# EAGLE design SSB Transceiver_Digital (EAGLE 9.4.2)
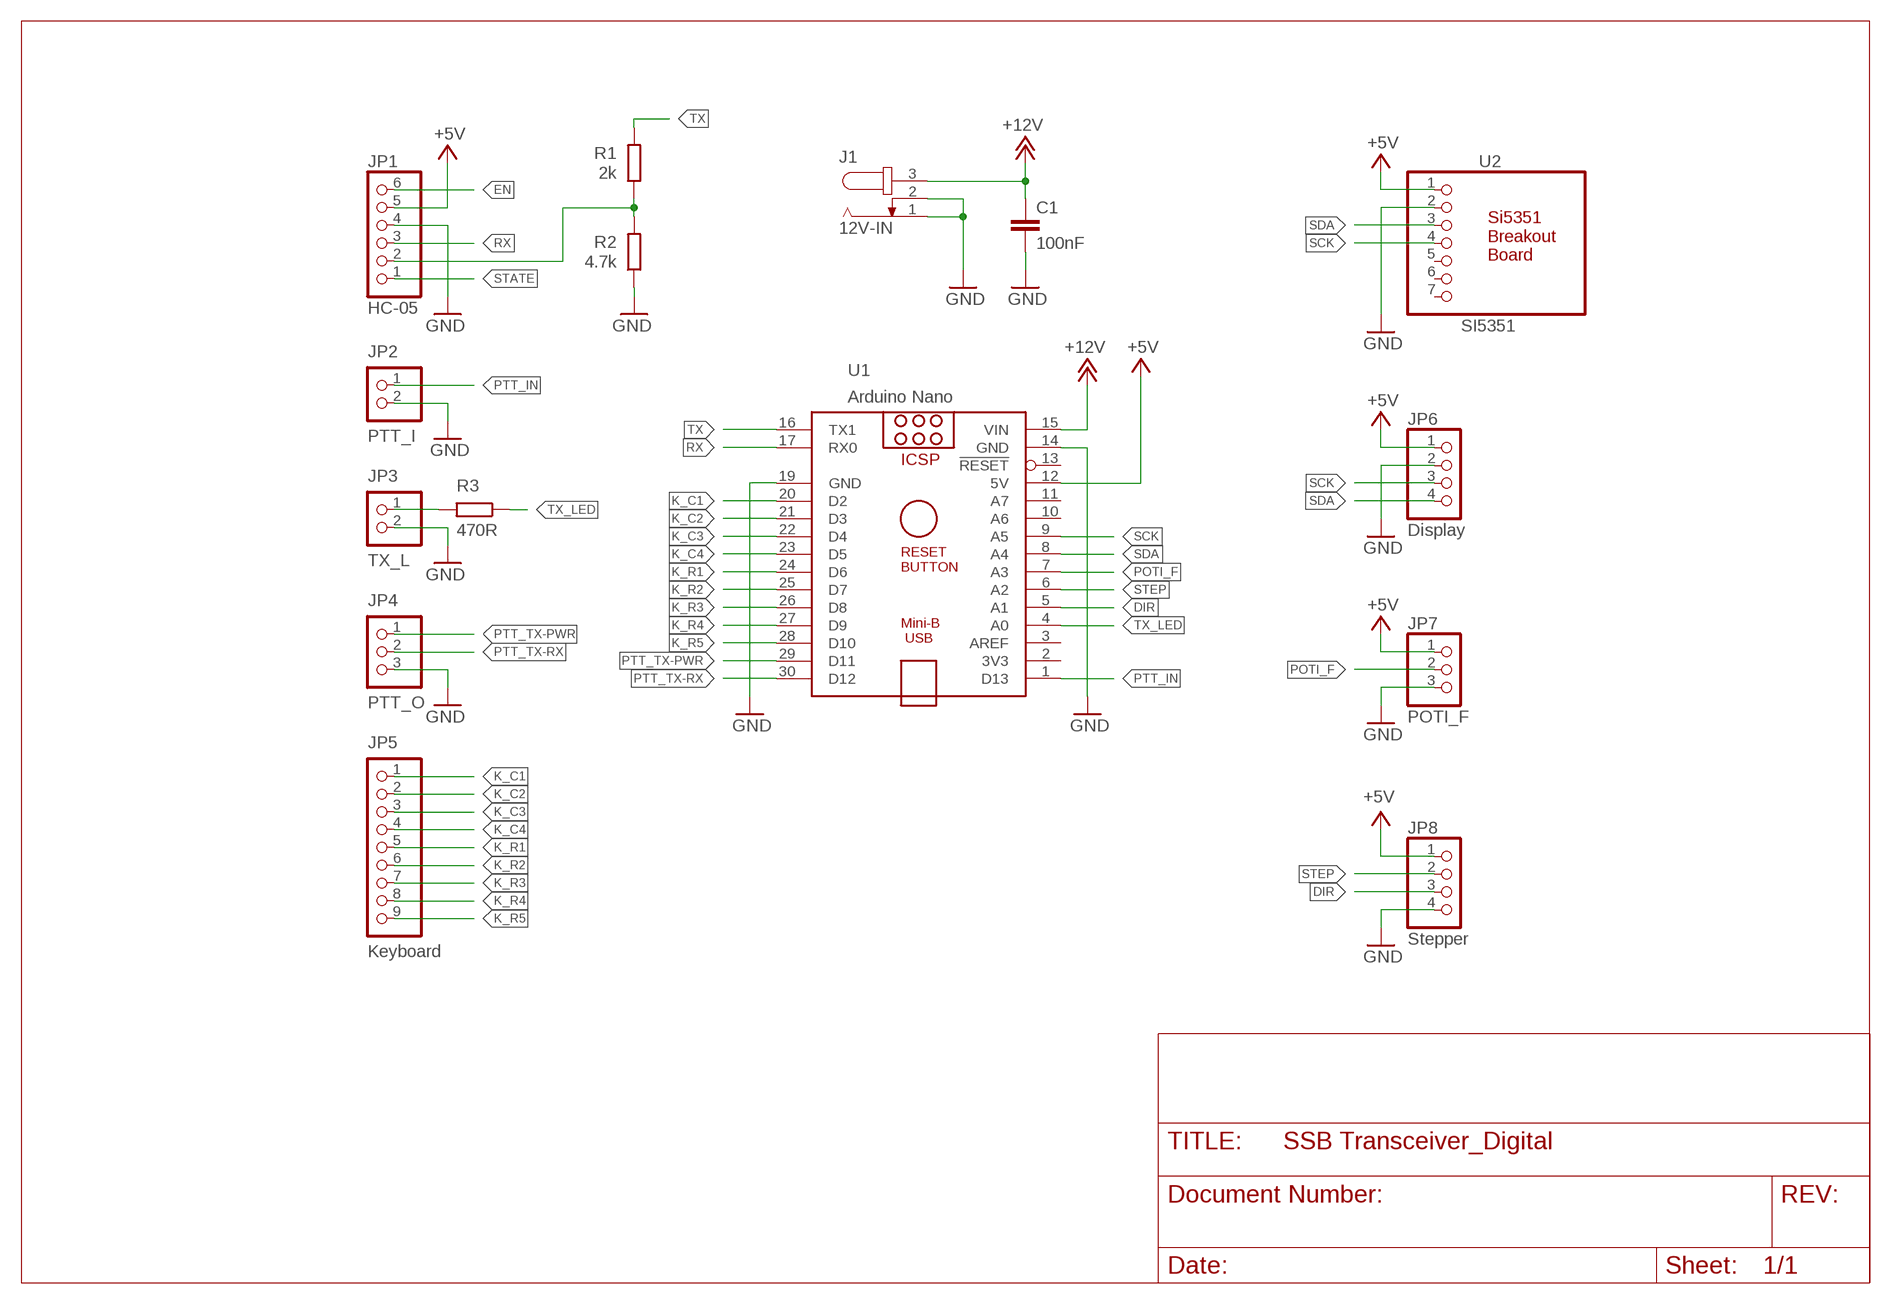
[diagram p0: schematic, sheet 1]

## Parts
C1  100nF  C-EUC0805K  [C0805K]
J1  12V-IN  JACK-PLUG1  [SPC4078]
JP1  HC-05  PINHD-1X6  [1X06]
JP2  PTT_I  PINHD-1X2  [1X02]
JP3  TX_L  PINHD-1X2  [1X02]
JP4  PTT_O  PINHD-1X3  [1X03]
JP5  Keyboard  PINHD-1X9  [1X09]
JP6  Display  PINHD-1X4  [1X04]
JP7  POTI_F  PINHD-1X3  [1X03]
JP8  Stepper  PINHD-1X4  [1X04]
R1  2k  R-EU_R0805  [R0805]
R2  4.7k  R-EU_R0805  [R0805]
R3  470R  R-EU_R0805  [R0805]
U1  Arduino Nano  ARDUINO_NANO  [ARDUINO_NANO]
U2  SI5351  [1X07]

## Nets
+5V: JP1.5 JP6.1 JP7.1 JP8.1 U1.12(5V) U2.1
+12V: C1.1 J1.3 U1.15(VIN)
DIR: JP8.3 U1.5(A1)
EN: JP1.6
GND: C1.2 J1.1 J1.2 JP1.4 JP2.2 JP3.2 JP4.3 JP6.2 JP7.3 JP8.4 R2.1 U1.14(GND) U1.19(GND) U2.2
K_C1: JP5.1 U1.20(D2)
K_C2: JP5.2 U1.21(D3)
K_C3: JP5.3 U1.22(D4)
K_C4: JP5.4 U1.23(D5)
K_R1: JP5.5 U1.24(D6)
K_R2: JP5.6 U1.25(D7)
K_R3: JP5.7 U1.26(D8)
K_R4: JP5.8 U1.27(D9)
K_R5: JP5.9 U1.28(D10)
N$1: JP3.1 R3.2
N$4: JP1.2 R1.1 R2.2
POTI_F: JP7.2 U1.7(A3)
PTT_IN: JP2.1 U1.1(D13)
PTT_TX-PWR: JP4.1 U1.29(D11)
PTT_TX-RX: JP4.2 U1.30(D12)
RX: JP1.3 U1.17(RX0)
SCK: JP6.3 U1.9(A5) U2.4
SDA: JP6.4 U1.8(A4) U2.3
STATE: JP1.1
STEP: JP8.2 U1.6(A2)
TX: R1.2 U1.16(TX1)
TX_LED: R3.1 U1.4(A0)
Unconnected: U1.2(3V3) U1.3(AREF) U1.10(A6) U1.11(A7) U1.13(!RESET) U2.5 U2.6 U2.7

## Library data of the parts
C1 = rcl:C-EU: CAPACITOR, European symbol; SPICEPREFIX: C
J1 = con-jack:JACK-PLUG: DC POWER JACK Power Jack, DC, Right Angle, Through Hole, Rated 5A at 16VDC, PC Terminals Distributor: Farnell (www.Farnell.de) Drawing: 84N1161.pdf / 84N1162.pdf Manufacturer: SPC Technology (www.spctechnology.com) Type: SPC4077 / SPC 4078; OC_FARNELL: unknown; OC_NEWARK: unknown
JP1 = pinhead:PINHD-1X6: PIN HEADER
JP2 JP3 = pinhead:PINHD-1X2: PIN HEADER
JP4 JP7 = pinhead:PINHD-1X3: PIN HEADER
JP5 = pinhead:PINHD-1X9: PIN HEADER
JP6 JP8 = pinhead:PINHD-1X4: PIN HEADER
R1-R3 = rcl:R-EU_: RESISTOR, European symbol; SPICEPREFIX: R
U1 = ArduinoNanoV30oR:ARDUINO_NANO: Arduino Nano V3.0 Overview: The Arduino Nano is a small, complete, and breadboard-friendly board based on the ATmega328 (Arduino Nano 3.x) or ATmega168 (Arduino Nano 2.x). It has more or less the same functionality of the Arduino Duemilanove, but in a different package. It lacks only a DC power jack, and works with a Mini-B USB cable instead of a standard one. The Nano was designed and is being produced by Gravitech. Specifications: Microcontroller Atmel ATmega168 or ATmega328 Operating Voltage (logic level) 5 V Input Voltage (recommended) 7-12 V Input Voltage (limits) 6-20 V Digital I/O Pins 14 (of which 6 provide PWM output) Analog Input Pins 8 DC Current per I/O Pin 40 mA Flash Memory 16 KB (ATmega168) or 32 KB (ATmega328) of which 2 KB used by bootloader SRAM 1 KB (ATmega168) or 2 KB (ATmega328) EEPROM 512 bytes (ATmega168) or 1 KB (ATmega328) Clock Speed 16 MHz Dimensions 0.73" x 1.70" Length 45 mm Width 18 mm Weigth 5 g Power: The Arduino Nano can be powered via the Mini-B USB connection, 6-20V unregulated external power supply (pin 30), or 5V regulated external power supply (pin 27). The power source is automatically selected to the highest voltage source. Memory: The ATmega168 has 16 KB of flash memory for storing code (of which 2 KB is used for the bootloader); the ATmega328 has 32 KB, (also with 2 KB used for the bootloader). The ATmega168 has 1 KB of SRAM and 512 bytes of EEPROM (which can be read and written with the EEPROM library); the ATmega328 has 2 KB of SRAM and 1 KB of EEPROM. Input and Output: Each of the 14 digital pins on the Nano can be used as an input or output, using pinMode(), digitalWrite(), and digitalRead() functions. They operate at 5 volts. Each pin can provide or receive a maximum of 40 mA and has an internal pull-up resistor (disconnected by default) of 20-50 kOhms. In addition, some pins have specialized functions. Visit Arduino - ArduinoBoardNano <https://www.arduino.cc/en/Main/ArduinoBoardNano>
U2 = Ham Radio:SI5351

## Board
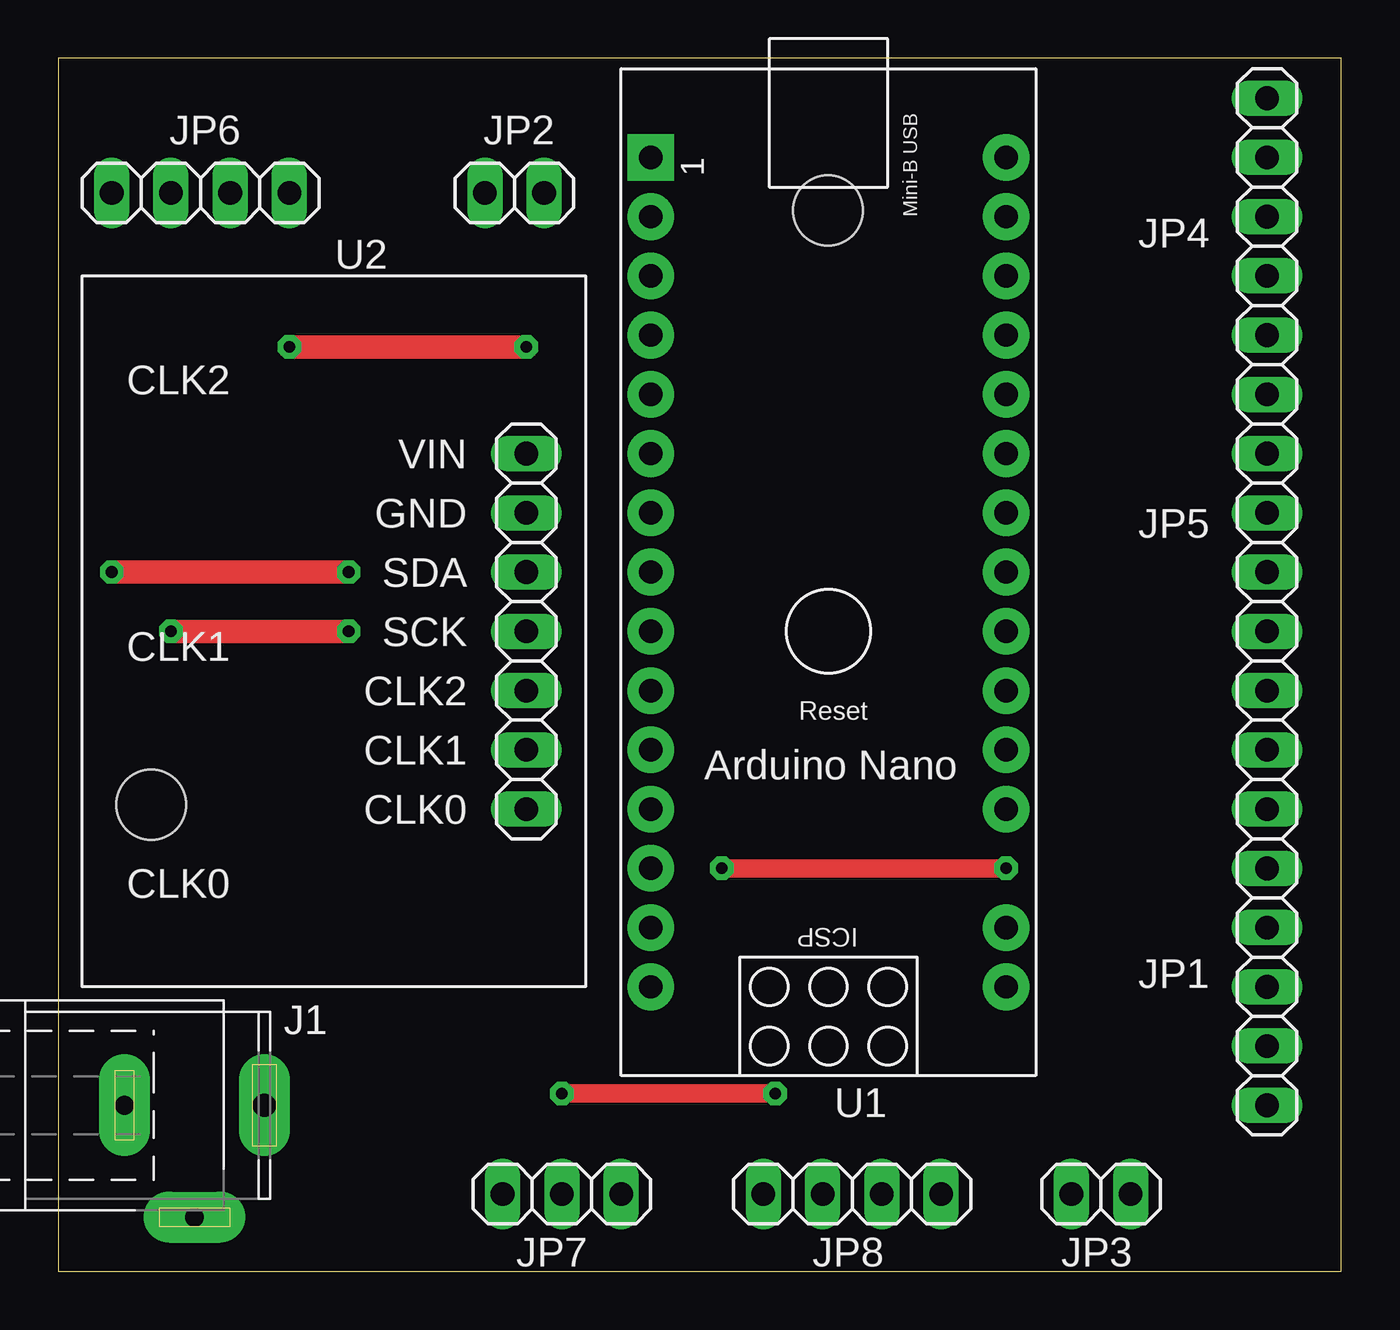
[diagram p1: board, top side]
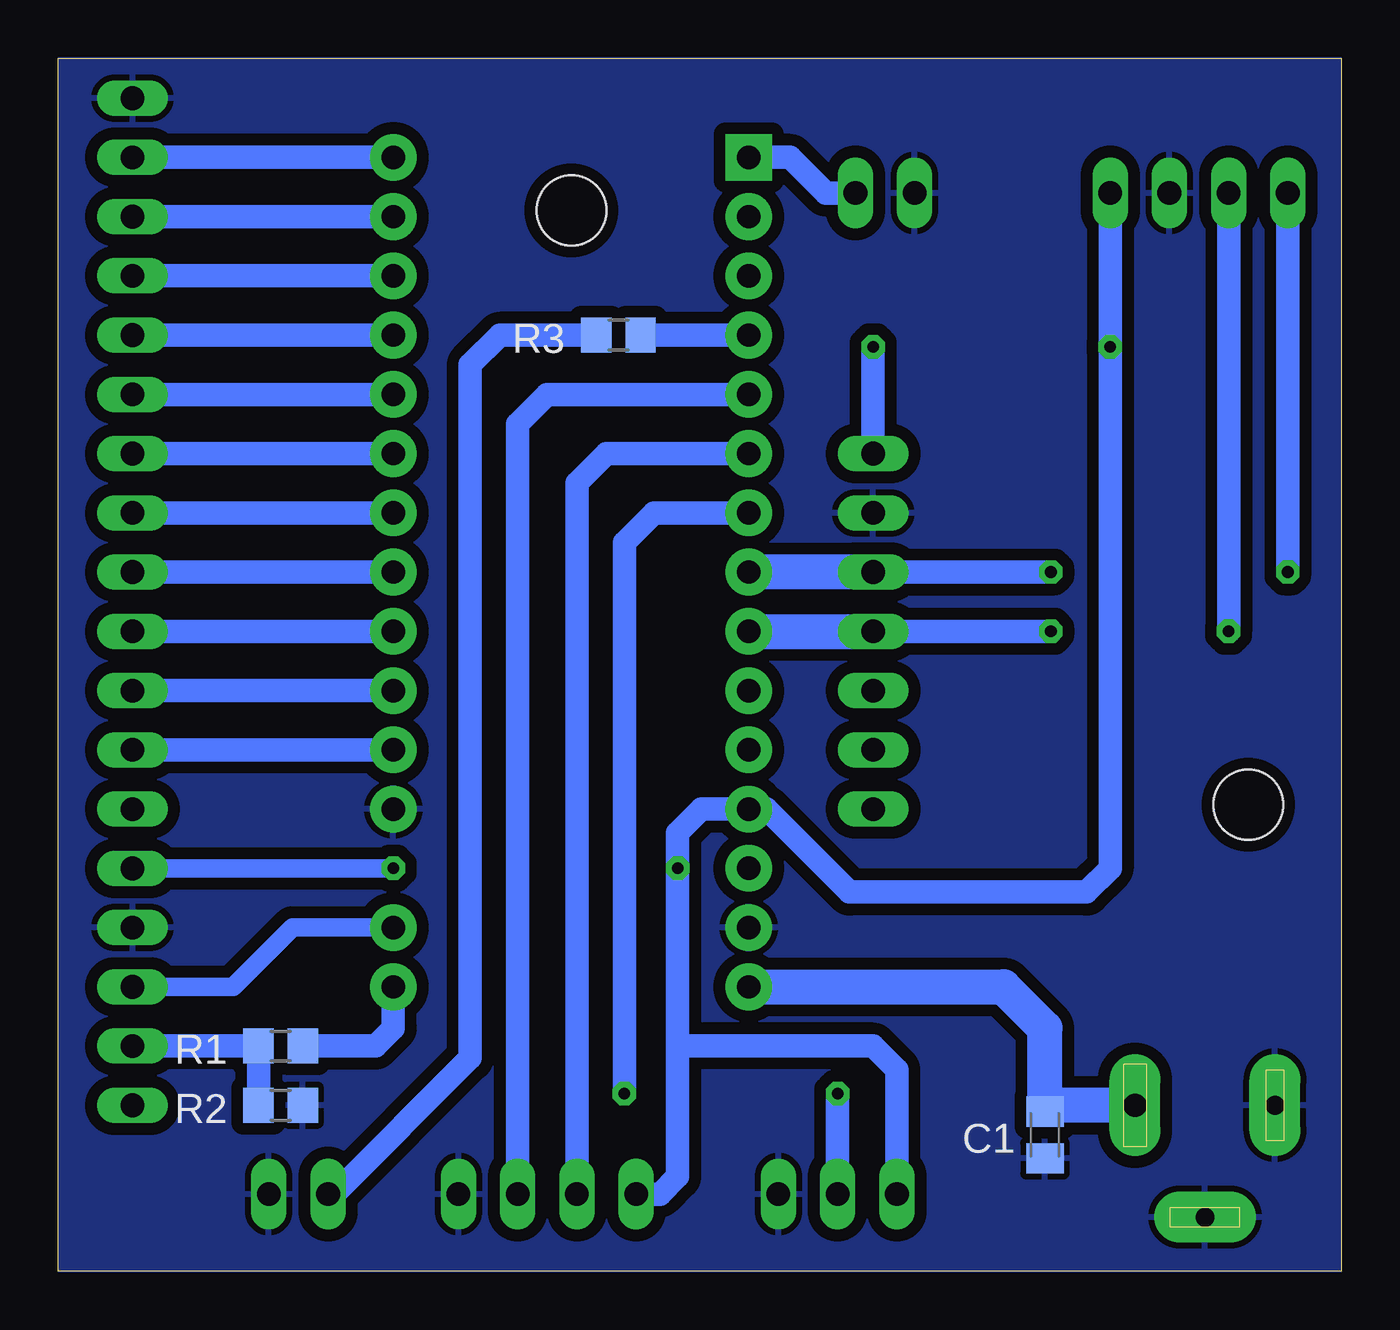
[diagram p2: board, bottom side, seen from below]

Size 55 x 52 mm. Coordinates in mm from the lower left corner, seen from the top.
Outline: 0,0 55,0 55,52 0,52 0,0
Copper layers (1*16): Top 0.035mm / dielectric 1.5mm / Bottom 0.035mm
Design rules "default *": minimum track width 6mil, minimum drill 0.35mm, track to track 20mil, track to pad 20mil, pad to pad 20mil, via to via 20mil, smd to smd 6mil, copper to edge 0mil, drill to drill 6mil, minimum pad ring 10mil, minimum via ring 8mil, stop-mask expansion 4mil, vias tented up to drill 0mil, thermal gap 10mil
Holes 3 mm at 3.98,20 33,45.48

### Footprints (pad centres in the part's own frame; a part is rotated, then mirrored left to right if it is on the bottom)
C0805K = smd 1.3 x 1.6: 1 -1,0; 2 1,0
SPC4078 = drill 0.8 pad 2.184 long: 1 -3,0; 2 0,-4.8 | drill 1 pad 2.184 long: 3 3,0
1X06 = drill 1.016 long: 1 -6.35,0; 2 -3.81,0; 3 -1.27,0; 4 1.27,0; 5 3.81,0; 6 6.35,0
1X02 = drill 1.016 long: 1 -1.27,0; 2 1.27,0
1X03 = drill 1.016 long: 1 -2.54,0; 2 0,0; 3 2.54,0
1X09 = drill 1.016 long: 1 -10.16,0; 2 -7.62,0; 3 -5.08,0; 4 -2.54,0; 5 0,0; 6 2.54,0; 7 5.08,0; 8 7.62,0; 9 10.16,0
1X04 = drill 1.016 long: 1 -3.81,0; 2 -1.27,0; 3 1.27,0; 4 3.81,0
R0805 = smd 1.3 x 1.5: 1 -0.95,0; 2 0.95,0
ARDUINO_NANO = drill 1 pad 2 square: 1 -20.32,-7.62 | drill 1 pad 2: 2 -17.78,-7.62; 3 -15.24,-7.62; 4 -12.7,-7.62; 5 -10.16,-7.62; 6 -7.62,-7.62; 7 -5.08,-7.62; 8 -2.54,-7.62; 9 0,-7.62; 10 2.54,-7.62; 11 5.08,-7.62; 12 7.62,-7.62; 13 10.16,-7.62; 14 12.7,-7.62; 15 15.24,-7.62; 16 15.24,7.62; 17 12.7,7.62; 19 7.62,7.62; 20 5.08,7.62; 21 2.54,7.62; 22 0,7.62; 23 -2.54,7.62; 24 -5.08,7.62; 25 -7.62,7.62; 26 -10.16,7.62; 27 -12.7,7.62; 28 -15.24,7.62; 29 -17.78,7.62; 30 -20.32,7.62
1X07 = drill 1.016 long: 1 2.54,7.62; 2 2.54,10.16; 3 2.54,12.7; 4 2.54,15.24; 5 2.54,17.78; 6 2.54,20.32; 7 2.54,22.86

### Placement (x,y rotation side)
C1  12.7,5.84 270 bottom
J1  5.84,7.11 0 top
JP1  51.82,13.46 90 top
JP2  19.56,46.23 180 top
JP3  44.7,3.3 0 top
JP4  51.82,47.75 90 top
JP5  51.82,32.51 90 top
JP6  6.1,46.23 180 top
JP7  21.59,3.3 0 top
JP8  34.04,3.3 0 top
R1  45.47,9.65 0 bottom
R2  45.47,7.11 180 bottom
R3  30.99,40.13 180 bottom
U1  33.02,27.43 270 top
U2  22.61,42.67 180 top

### Tracks (layer width: path | path; a pad name or v marks a point on that pad's centre or on a via)
+5V  (via drill 0.5 pad 1)
  Top 0.8: v40.64,17.27 v28.45,17.27
  Top 1: v9.91,39.62 v20.07,39.62
  Bottom 0.8: v40.64,17.27 JP1.5
  Bottom 1: JP7.1 19.05,8.64 20.07,9.65 28.45,9.65 | JP6.1 v9.91,39.62 9.91,17.27 10.92,16.26 21.08,16.26 24.64,19.81 U1.12 27.43,19.81 28.45,18.8 v28.45,17.27 28.45,9.65 | v20.07,39.62 U2.1 | 28.45,9.65 28.45,4.06 29.21,3.3 JP8.1
+12V
  Bottom 1: C1.1 12.7,7.11
  Bottom 1.5: U1.15 14.48,12.19 12.7,10.41 12.7,7.11 J1.3
DIR
  Bottom 1: JP8.3 35.31,36.32 34.04,37.59 U1.5
GND
  pour Bottom (isolate 0.5): 0,0 0,52 55,52 55,0
K_C1
  Bottom 1: U1.20 JP5.1
K_C2
  Bottom 1: JP5.2 U1.21
K_C3
  Bottom 1: U1.22 JP5.3
K_C4
  Bottom 1: JP5.4 U1.23
K_R1
  Bottom 1: U1.24 JP5.5
K_R2
  Bottom 1: U1.25 JP5.6
K_R3
  Bottom 1: U1.26 JP5.7
K_R4
  Bottom 1: JP5.8 U1.27
K_R5
  Bottom 1: U1.28 JP5.9
N$1
  Bottom 1: R3.2 36.07,40.13 37.34,38.86 37.34,9.14 43.18,3.3 JP3.1
N$4
  Bottom 1: JP1.2 R1.1 R2.2
POTI_F  (via drill 0.5 pad 1)
  Top 0.8: v30.73,7.62 v21.59,7.62
  Bottom 1: v30.73,7.62 30.73,31.24 29.46,32.51 U1.7 | v21.59,7.62 JP7.2
PTT_IN
  Bottom 1: U1.1 23.62,47.75 22.1,46.23 JP2.1
PTT_TX-PWR
  Bottom 1: JP4.1 U1.29
PTT_TX-RX
  Bottom 1: U1.30 JP4.2
RX
  Bottom 0.8: JP1.3 47.5,12.19 44.96,14.73 U1.17
SCK  (via drill 0.5 pad 1)
  Top 1: v4.83,27.43 v12.45,27.43
  Bottom 1: v12.45,27.43 U2.4 | JP6.3 v4.83,27.43
  Bottom 1.5: U1.9 U2.4
SDA  (via drill 0.5 pad 1)
  Top 1: v12.45,29.97 v2.29,29.97
  Bottom 1: JP6.4 v2.29,29.97 | U2.3 v12.45,29.97
  Bottom 1.5: U2.3 U1.8
STEP
  Bottom 1: JP8.2 32.77,33.78 31.5,35.05 U1.6
TX
  Bottom 1: R1.2 41.4,9.65 40.64,10.41 U1.16
TX_LED
  Bottom 1: R3.1 U1.4